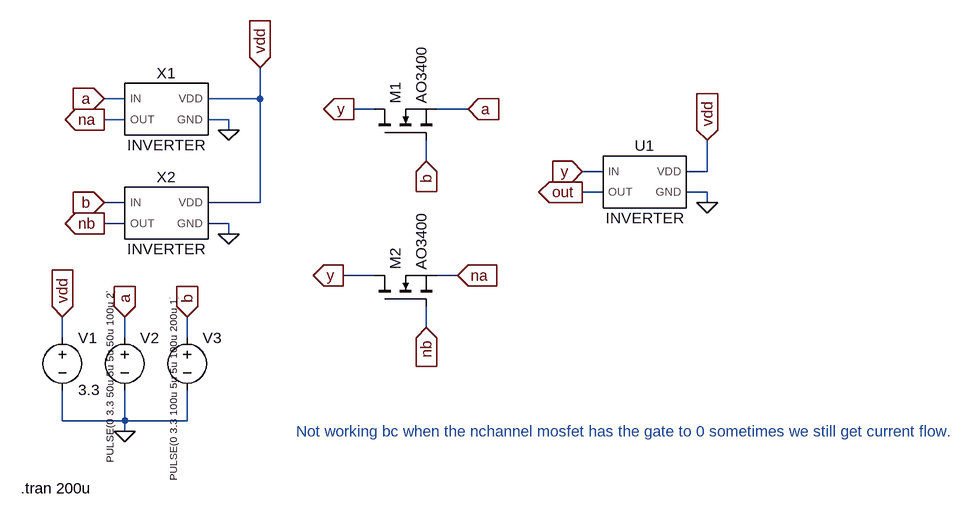
[diagram p0: schematic xor_tg_raw3.asc]
xor_tg_raw3.asc, the LTspice schematic file:
Version 4.1
SHEET 1 1368 1020
WIRE -16 80 -48 80
WIRE 192 80 192 32
WIRE 192 80 112 80
WIRE 368 96 336 96
WIRE 512 96 464 96
WIRE -16 112 -48 112
WIRE 144 112 112 112
WIRE 144 128 144 112
WIRE 448 176 448 144
WIRE 720 192 688 192
WIRE 880 192 880 144
WIRE 880 192 848 192
WIRE 720 224 688 224
WIRE 880 224 848 224
WIRE -16 240 -48 240
WIRE 192 240 192 80
WIRE 192 240 112 240
WIRE 880 240 880 224
WIRE -16 272 -48 272
WIRE 144 272 112 272
WIRE 144 288 144 272
WIRE 368 352 320 352
WIRE 496 352 464 352
WIRE 448 432 448 400
WIRE -112 448 -112 416
WIRE -16 448 -16 416
WIRE 80 448 80 416
WIRE -112 576 -112 528
WIRE -16 576 -16 528
WIRE -16 576 -112 576
WIRE 80 576 80 528
WIRE 80 576 -16 576
WIRE -16 592 -16 576
FLAG -48 80 a
IOPIN -48 80 In
FLAG -48 112 na
IOPIN -48 112 Out
FLAG 144 128 0
FLAG 144 288 0
FLAG -48 240 b
IOPIN -48 240 In
FLAG -48 272 nb
IOPIN -48 272 Out
FLAG -16 592 0
FLAG -112 416 vdd
IOPIN -112 416 In
FLAG -16 416 a
IOPIN -16 416 In
FLAG 80 416 b
IOPIN 80 416 In
FLAG 192 32 vdd
IOPIN 192 32 In
FLAG 336 96 y
IOPIN 336 96 Out
FLAG 448 176 b
IOPIN 448 176 In
FLAG 320 352 y
IOPIN 320 352 Out
FLAG 448 432 nb
IOPIN 448 432 In
FLAG 688 192 y
IOPIN 688 192 In
FLAG 688 224 out
IOPIN 688 224 Out
FLAG 880 240 0
FLAG 880 144 vdd
IOPIN 880 144 In
FLAG 512 96 a
IOPIN 512 96 In
FLAG 496 352 na
IOPIN 496 352 In
SYMBOL inverter 48 96 R0
SYMATTR InstName X1
SYMATTR SpiceModel ""
SYMBOL inverter 48 256 R0
SYMATTR InstName X2
SYMATTR SpiceModel ""
SYMBOL voltage -112 432 R0
WINDOW 123 0 0 Left 0
WINDOW 39 0 0 Left 0
SYMATTR InstName V1
SYMATTR Value 3.3
SYMBOL voltage -16 432 R0
WINDOW 3 -23 209 VLeft 1
WINDOW 123 0 0 Left 0
WINDOW 39 0 0 Left 0
SYMATTR Value PULSE(0 3.3 50u 5u 5u 50u 100u 2)
SYMATTR InstName V2
SYMBOL voltage 80 432 R0
WINDOW 3 -21 237 VLeft 1
WINDOW 123 0 0 Left 0
WINDOW 39 0 0 Left 0
SYMATTR Value PULSE(0 3.3 100u 5u 5u 100u 200u 1)
SYMATTR InstName V3
SYMBOL nmos 368 144 R270
SYMATTR InstName M1
SYMATTR Value AO3400
SYMBOL nmos 368 400 R270
SYMATTR InstName M2
SYMATTR Value AO3400
SYMBOL inverter 784 208 R0
SYMATTR InstName U1
TEXT -176 680 Left 2 !.tran 200u
TEXT 248 592 Left 2 ;Not working bc when the nchannel mosfet has the gate to 0 sometimes we still get current flow.

The netlist it stands for:
* xor_tg_raw3.asc
X§X1 a na vdd 0 INVERTER  ; pins IN OUT VDD GND
X§X2 b nb vdd 0 INVERTER  ; pins IN OUT VDD GND
V1 vdd 0 3.3
V2 a 0 PULSE(0 3.3 50u 5u 5u 50u 100u 2)
V3 b 0 PULSE(0 3.3 100u 5u 5u 100u 200u 1)
M1 y b a a AO3400
M2 y nb na na AO3400
X§U1 y out vdd 0 INVERTER INVERTER  ; pins IN OUT VDD GND
.model NMOS NMOS
.model PMOS PMOS
.lib standard.mos
.tran 200u
* Not working bc when the nchannel mosfet has the gate to 0 sometimes we still get current flow.
.lib yap_cells.lib
.backanno
.end